# EAGLE design blinkm_mk2v5bb (EAGLE 6.6.0)
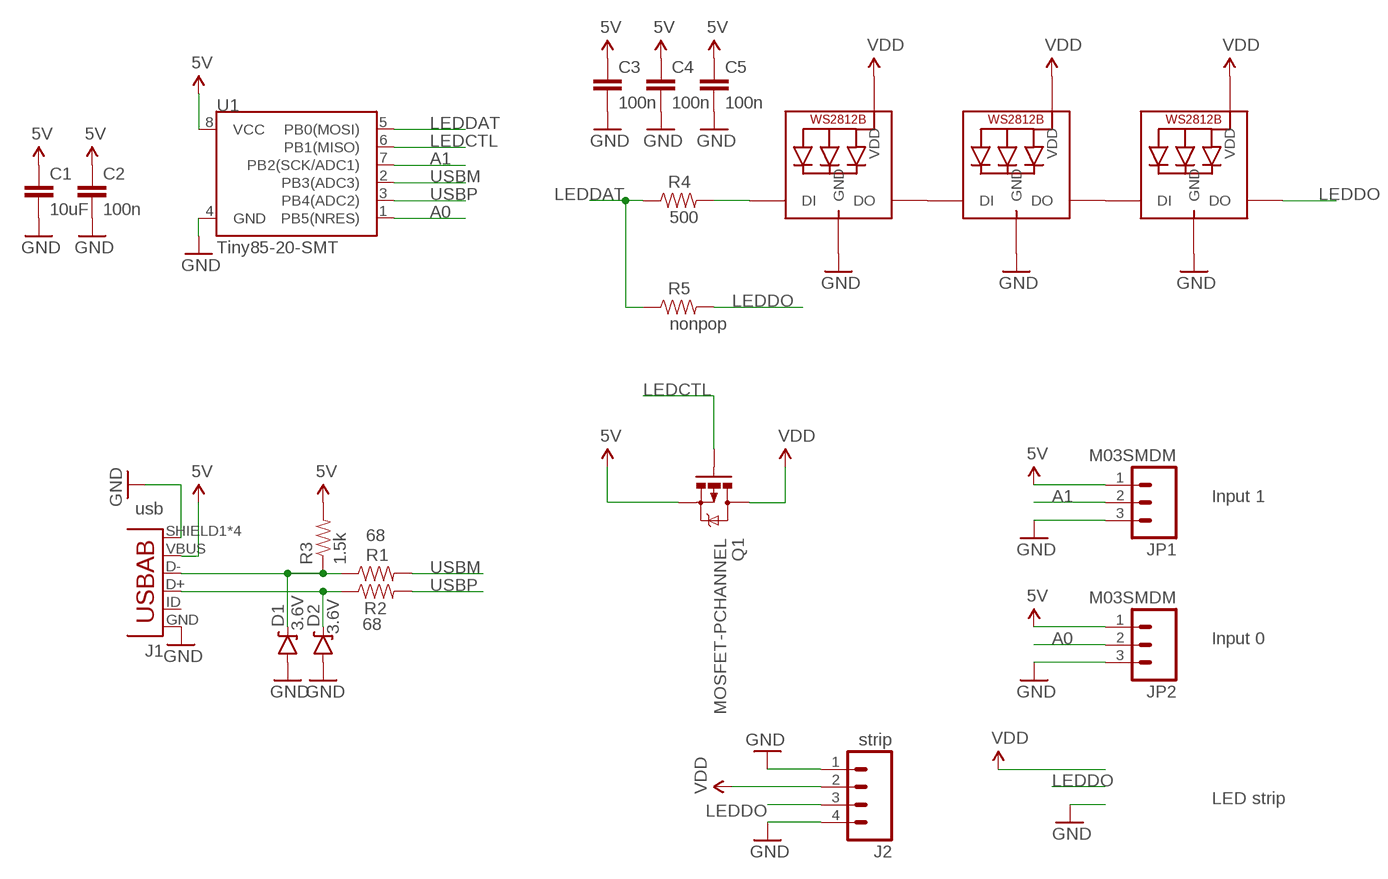
[diagram p0: schematic, sheet 1]

## Parts
C1  10uF  CAP0603-CAP  [0603-CAP]
C2  100n  CAP0603-CAP  [0603-CAP]
C3  100n  CAP0603-CAP  [0603-CAP]
C4  100n  CAP0603-CAP  [0603-CAP]
C5  100n  CAP0603-CAP  [0603-CAP]
D1  3.6V  DIODE-ZENER3.3V  [SOD-323]
D2  3.6V  DIODE-ZENER3.3V  [SOD-323]
J1  usb  USB-AB  [USB-AB-MICRO-SMD]
J2  strip  M04NO_SILK_ALL_ROUND  [1X04_NO_SILK_ALL_ROUND]
JP1  M03SMDM  [1X03-SMD-MINIMAL]
JP2  M03SMDM  [1X03-SMD-MINIMAL]
LED1  WS2812B3535  [LED3535]
LED2  WS2812B3535  [LED3535]
LED3  WS2812B3535  [LED3535]
Q1  MOSFET-PCHANNEL  [SOT23-3]
R1  68  RESISTOR0603-RES  [0603-RES]
R2  68  RESISTOR0603-RES  [0603-RES]
R3  1.5k  RESISTOR0603-RES  [0603-RES]
R4  500  RESISTOR0603-RES  [0603-RES]
R5  nonpop  RESISTOR0603-RES  [0603-RES]
U1  Tiny85-20-SMT  ATTINY45TINY85-20-SMT  [SO08-EIAJ]

## Nets
5V: C1.1 C2.1 C3.1 C4.1 C5.1 J1.VBUS JP1.1 JP2.1 Q1.2(S) R3.2 U1.8(VCC)
A0: JP2.2 U1.1(PB5(NRES))
A1: JP1.2 U1.7(PB2(SCK/ADC1))
GND: C1.2 C2.2 C3.2 C4.2 C5.2 D1.A D2.A J1.GND J1.SHIELD1(SHIELD) J1.SHIELD2(SHIELD) J1.SHIELD3(SHIELD) J1.SHIELD4(SHIELD) J2.1 J2.4 JP1.3 JP2.3 LED1.4(GND) LED2.4(GND) LED3.4(GND) U1.4(GND)
LEDCTL: Q1.1(G) U1.6(PB1(MISO))
LEDDAT: R4.1 R5.1 U1.5(PB0(MOSI))
LEDDO: J2.3 LED3.3(DO) R5.2
N$1: LED1.3(DO) LED2.1(DI)
N$2: LED2.3(DO) LED3.1(DI)
N$3: D1.C J1.D- R1.1 R3.1
N$4: D2.C J1.D+ R2.1
N$5: LED1.1(DI) R4.2
USBM: R1.2 U1.2(PB3(ADC3))
USBP: R2.2 U1.3(PB4(ADC2))
VDD: J2.2 LED1.2(VDD) LED2.2(VDD) LED3.2(VDD) Q1.3(D)
Unconnected: J1.ID(USBID)

## Notes on the sheet
- Input 1
- Input 0
- LED strip

## Library data of the parts
C1-C5 = SparkFun-Capacitors:CAP: Capacitor Standard 0603 ceramic capacitor, and 0.1" leaded capacitor.
D1 D2 = SparkFun-DiscreteSemi:DIODE-ZENER: Zener Diode Production Part - 8199 3.4V Zener Voltage; PROD_ID: DIO-11284; VALUE: 3.3V
J1 = SparkFun-Connectors:USB-AB: This is a USB AB connector that is compatible with USB OTG. i.e. this connector can serve as a host or device
J2 = SparkFun-Connectors:M04: Header 4 Standard 4-pin 0.1" header. Use with straight break away headers (SKU : PRT-00116), right angle break away headers (PRT-00553), swiss pins (PRT-00743), machine pins (PRT-00117), and female headers (PRT-00115). Molex polarized connector foot print use with SKU : PRT-08231 with associated crimp pins and housings. 1MM SMD Version SKU: PRT-10208; PROD_ID: CONN-09696
JP1 JP2 = todstuff:M03
LED1-LED3 = adafruit:WS2812B
Q1 = SparkFun-DiscreteSemi:MOSFET-PCHANNEL: Generic PMOSFET IRLML2244 - TRANS-11153 (SOT-23 -20V -4.3A) (1.Gate 2.Source 3.Drain) FQP27P06 - COM-10349 <http://www.sparkfun.com/products/10349> (TO-220 -60V -27A) (1.Gate 2.Source 3.Drain); PROD_ID: TRANS-08285
R1-R5 = SparkFun-Passives:RESISTOR: Resistor Basic schematic elements and footprints for 0603, 1206, and PTH resistors.
U1 = SparkFun-DigitalIC:ATTINY45: Atmel 8-pin 2/4/8kB flash uC; PROD_ID: IC-09092

## Board
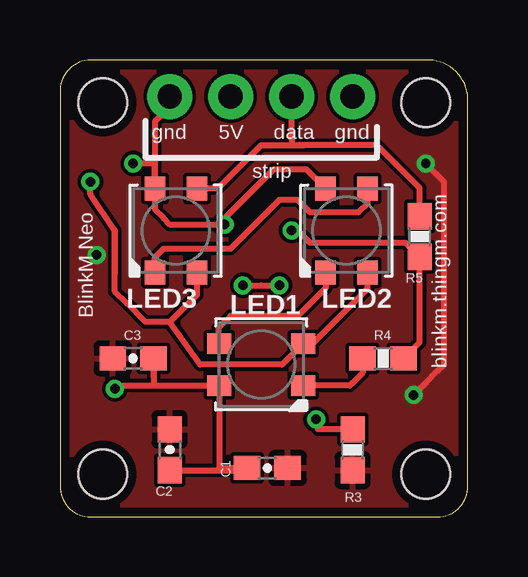
[diagram p1: board, top side]
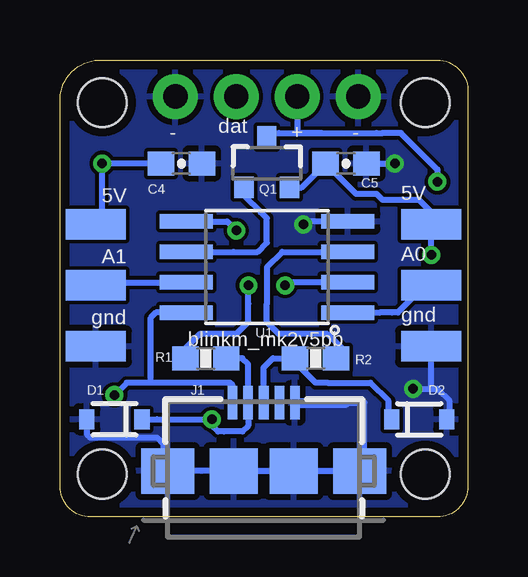
[diagram p2: board, bottom side, seen from below]

Size 17 x 19.05 mm. Coordinates in mm from the lower left corner, seen from the top.
Outline: 0,17.7 0,1.27 arc90 1.27,0 15.73,0 arc90 17,1.27 17,17.45 arc90 15.24,19.05 1.27,19.05 arc90 0,17.7
Copper layers (1*16): Top 0.0356mm / dielectric 1.5011mm / Bottom 0.0356mm
Design rules "LaenPCBOrder *": minimum track width 6mil, minimum drill 13mil, track to track 6mil, track to pad 6mil, pad to pad 6mil, via to via 6mil, smd to smd 6mil, copper to edge 15mil, drill to drill 6mil, minimum pad ring 7mil, minimum via ring 7mil, stop-mask expansion 3mil, vias tented up to drill 20mil, thermal gap 10mil
Holes 2.03 mm at 15.24,1.78 15.24,17.27 1.78,1.78 1.78,17.27

### Footprints (pad centres in the part's own frame; a part is rotated, then mirrored left to right if it is on the bottom)
0603-CAP = smd 1.1 x 1: 1 -0.85,0; 2 0.85,0
SOD-323 = smd 0.63 x 0.83: A 1.15,0; C -1.15,0
USB-AB-MICRO-SMD = smd 1.4 x 0.4: D+ 2.85,0; D- 2.85,0.65; GND 2.85,-1.3; ID 2.85,-0.65; VBUS 2.85,1.3 | smd 1.9 x 2.2: SHIELD1 0,4; SHIELD4 0,-4 | smd 1.9 x 2: SHIELD2 0,1.25; SHIELD3 0,-1.25
1X04_NO_SILK_ALL_ROUND = drill 1.016 pad 1.88: 1 0,0; 2 2.54,0; 3 5.08,0; 4 7.62,0
1X03-SMD-MINIMAL = smd 1.27 x 2.5: 1 -2.54,-0.01; 2 0,-0.01; 3 2.54,-0.01
LED3535 = smd 1 x 0.85: 1 -1.75,0.875; 2 -1.75,-0.875; 3 1.75,-0.875; 4 1.75,0.875
SOT23-3 = smd 0.8 x 0.9: 1 -0.95,-1; 2 0.95,-1; 3 0,1.1
0603-RES = smd 1.1 x 1: 1 -0.85,0; 2 0.85,0
SO08-EIAJ = smd 0.61 x 2.21: 1 -1.905,-3.378; 2 -0.635,-3.378; 3 0.635,-3.378; 4 1.905,-3.378; 5 1.905,3.353; 6 0.635,3.353; 7 -0.635,3.353; 8 -1.905,3.353

### Placement (x,y rotation side)
C1  8.64,2.03 180 top
C2  4.57,2.79 270 top
C3  3.05,6.6 0 top
C4  11.94,14.73 0 bottom
C5  5.08,14.73 0 bottom
D1  14.73,4.06 180 bottom
D2  2.03,4.06 0 bottom
J1  8.51,1.91 90 bottom
J2  4.57,17.53 0 top
JP1  15.49,9.65 270 bottom
JP2  1.52,9.65 270 bottom
LED1  8.38,6.35 180 top
LED2  11.94,11.94 90 top
LED3  4.83,11.94 90 top
Q1  8.38,14.73 0 bottom
R1  10.92,6.6 180 bottom
R2  6.35,6.6 0 bottom
R3  12.19,2.79 270 top
R4  13.46,6.6 180 top
R5  14.99,11.68 90 top
U1  8.38,10.41 90 bottom

### Tracks (layer width: path | path; a pad name or v marks a point on that pad's centre or on a via)
5V  (via drill 0.39)
  Top 0.254: v14.73,5.08 15.24,5.59 15.75,6.1 16,6.35 16,13.72 16,13.97 v15.24,14.73
  Bottom 0.254: 13.21,5.59 11.01,5.59 9.91,5.59 9.81,5.49 J1.VBUS | 13.21,5.59 13.21,8.31 13.01,8.51 12.7,8.51 U1.8 | v1.52,10.92 1.53,10.93 JP2.1 1.53,12.71 2.03,13.21 3.56,13.21 3.81,13.46 4.66,13.46 C5.1 6.93,13.73 Q1.2 7.43,13.63 | 15.24,12.18 JP1.1 15.25,12.45 15.25,13.97 v15.24,14.73 13.8,14.73 C4.1 | 13.21,5.59 14.22,5.59 v14.73,5.08
  pour Top: 0,18.54 17.53,18.8 17.78,0 -2.54,0 -2.29,16.51
A0
  Bottom 0.254: U1.1 3.68,8.51 3.17,8.51 2.92,8.51 1.78,9.65 JP2.2
A1
  Bottom 0.254: JP1.2 15.12,9.53 14.87,9.78 U1.7
GND  (via drill 0.39)
  Top 0.254: LED3.4 3.95,12.81 4.32,12.45 4.57,12.19 v6.86,12.19 6.86,12.45 8.89,14.48 9.14,14.48 10.27,14.48 LED2.4 | 3.9,5.84 C3.2 3.9,5.47 | v2.29,5.33 2.37,5.33 2.63,5.47 3.9,5.47 | 3.9,5.47 LED1.4 6.63,2.03 C1.2 7.79,1.94 C2.2 | LED3.4 3.95,16.48 4.57,17.1 J2.1 | LED3.4 3.95,14.73 v3.05,14.73
  Bottom 0.254: J1.SHIELD1 J1.SHIELD2 J1.SHIELD3 J1.SHIELD4 4.32,1.97 4.32,4.75 5.08,4.75 | JP2.3 | U1.4 6.73,12.32 v6.86,12.19 | 1.02,3.81 0.76,4.06 0.76,4.83 1.27,5.33 1.52,5.33 | 1.52,5.33 JP2.3 | v2.29,5.33 1.52,5.33 | 15.63,7.1 15.24,7.1 JP1.3 15.88,7.11 | 12.64,2.29 J1.SHIELD1 | D1.A 15.88,3.44 15.75,3.3 12.95,3.3 12.7,3.05 12.7,2.1 J1.SHIELD1 | C5.2 v3.05,14.73
  Bottom 0.406: J1.GND 5.08,4.75
  pour Bottom: 0,19.05 18.03,18.8 17.78,0 -1.27,0 -1.27,17.78
LEDCTL
  Bottom 0.254: U1.6 9.78,11.05 8.76,11.05 8.38,11.43 8.38,12.45 8.64,12.7 9.33,13.4 9.33,13.46 Q1.1
LEDDAT  (via drill 0.39)
  Top 0.254: R4.1 14.48,6.77 14.99,7.28 R5.1 | 14.82,10.83 R5.1 | R5.1 14.39,11.43 10.41,11.43 9.91,11.94 v9.65,11.94
  Bottom 0.254: U1.5 10.03,12.32 v9.65,11.94
LEDDO
  Top 0.254: LED3.3 5.73,13.72 6.6,13.72 8.38,15.49 10.16,15.49 | J2.3 9.65,15.75 9.65,15.49 10.16,15.49 | R5.2 14.99,13.72 13.97,14.73 13.21,15.49 10.16,15.49 | 10.16,15.49 9.91,15.49
N$1
  Top 0.254: LED2.1 11.06,9.54 9.91,8.38 8.64,8.38 7.11,8.38 6.6,7.87 6.6,7.25 LED1.3
N$2
  Top 0.254: LED2.3 12.81,13.07 12.45,12.7 10.67,12.7 10.41,12.7 9.91,13.21 9.14,13.21 8.64,12.7 7.87,11.94 7.62,11.68 7.11,11.18 6.86,11.18 6.35,11.18 4.32,11.18 3.95,10.81 LED3.1
N$3  (via drill 0.39)
  Top 0.254: R3.1 10.76,3.64 v10.67,4.06
  Bottom 0.254: D1.C 12.95,4.06 v10.67,4.06 10.67,3.81 10.41,3.56 10.16,3.56 9.4,3.56 9.16,3.79 J1.D- 9.16,5.95 9.16,6.37 9.4,6.6 R1.1
N$4
  Bottom 0.254: D2.C 3.3,4.18 3.3,4.83 4.06,5.59 5.84,5.59 6.1,5.59 6.35,5.59 6.6,5.84 7.2,6.44 R2.1 | 7.11,6.6 R2.1 | J1.D+ 8.51,6.22 8.13,6.6 R2.1
N$5
  Top 0.254: R4.2 12.61,6.01 12.19,5.59 12.08,5.47 LED1.1
USBM  (via drill 0.39)
  Top 0.254: v7.62,9.65 8.38,9.65 v9.14,9.65
  Bottom 0.254: v9.14,9.65 9.14,8.89 9.14,8.13 9.65,7.62 11.18,7.62 11.43,7.37 11.77,7.02 R1.2 | U1.2 7.49,9.78 v7.62,9.65
USBP
  Bottom 0.254: U1.3 7.75,11.05 8.38,10.41 8.38,9.49 8.38,8.89 8.38,8.13 7.87,7.62 5.84,7.62 5.59,7.37 5.25,7.02 R2.2
VDD  (via drill 0.39)
  Top 0.254: 2.29,11.94 2.29,10.16 | 2.29,10.16 2.29,9.4 2.79,8.89 3.56,8.13 4.57,8.13 | 2.29,10.16 2.29,11.94 | 4.57,8.13 5.84,6.35 9.26,6.35 LED1.2 10.53,7.22 12.79,9.48 12.81,9.51 LED2.2 | LED3.2 5.7,10.3 5.7,9.26 4.57,8.13 | 2.29,11.94 1.27,13.46 v1.27,13.97
  Bottom 0.254: Q1.3 8.38,16 7.87,16 7.11,16 | 7.11,16 6.1,16 | 6.1,16 3.81,16 3.56,16 2.79,16 1.27,14.48 v1.27,13.97 1.27,14.22 | 6.1,16 7.11,16 | J2.2 7.11,16

### Text on the board
tPlace: gnd | 5V | data | gnd | strip | BlinkM Neo | blinkm.thingm.com
bPlace: - | + | dat | - | 5V | 5V | A0 | A1 | gnd | gnd | blinkm_mk2v5bb